# EAGLE design Crutch_Light (EAGLE 9.6.2)
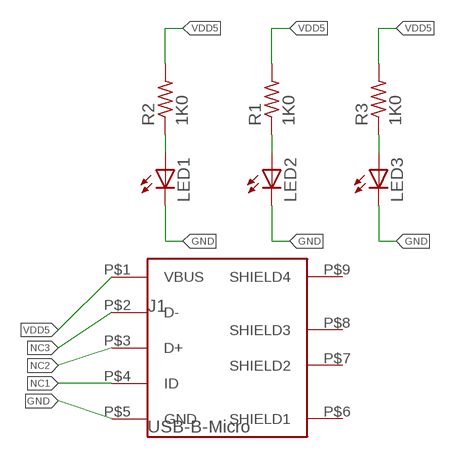
[diagram p0: schematic, sheet 1]

## Parts
J1  USB-B-Micro  USB_MICRO-B  [USB_MICRO-B]
LED1  Green  LED_0805_GREEN  [0805]
LED2  Green  LED_0805_GREEN  [0805]
LED3  Green  LED_0805_GREEN  [0805]
R1  1K0  R_0402_1K0  [0402]
R2  1K0  R_0402_1K0  [0402]
R3  1K0  R_0402_1K0  [0402]

## Nets
GND: J1.P$5(GND) LED1.2(C) LED2.2(C) LED3.2(C)
N$1: LED1.1(A) R2.P$1
N$2: LED2.1(A) R1.P$1
N$3: LED3.1(A) R3.P$1
NC1: J1.P$4(ID)
NC2: J1.P$3(D+)
NC3: J1.P$2(D-)
VDD5: J1.P$1(VBUS) R1.P$2 R2.P$2 R3.P$2
Unconnected: J1.P$6(SHIELD1) J1.P$7(SHIELD2) J1.P$8(SHIELD3) J1.P$9(SHIELD4)

## Library data of the parts
J1 = 3D_MIG_Controller:USB_MICRO-B; PARTNO: 10118192-0002LF
LED1-LED3 = 3D_MIG_Controller:LED_0805_GREEN: Green 570nm LED Indication - Discrete 2.2V 0805 (2012 Metric); PARTNO: LG R971-KN-1
R1-R3 = 3D_MIG_Controller:R_0402_1K0; PARTNO: CRG0402J1K0

## Board
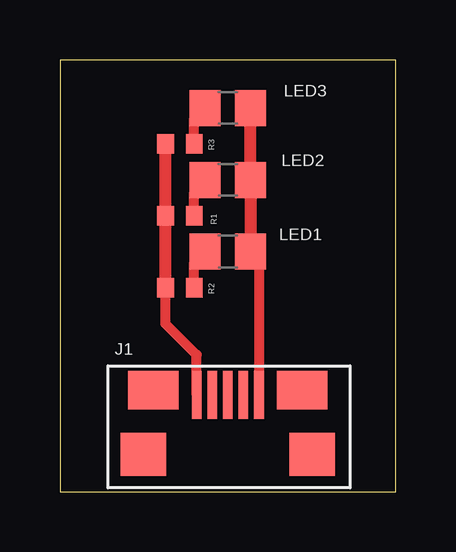
[diagram p1: board, top side]

Size 14 x 18 mm. Coordinates in mm from the lower left corner, seen from the top.
Outline: 0,0 14,0 14,18 0,18 0,0
Copper layers (1*16): Top 0.035mm / dielectric 1.5mm / Bottom 0.035mm
Design rules "default": minimum track width 6mil, minimum drill 0.35mm, track to track 6mil, track to pad 6mil, pad to pad 6mil, via to via 6mil, smd to smd 6mil, copper to edge 40mil, drill to drill 6mil, minimum pad ring 10mil, minimum via ring 8mil, stop-mask expansion 4mil, vias tented up to drill 0mil, thermal gap 10mil

### Footprints (pad centres in the part's own frame; a part is rotated, then mirrored left to right if it is on the bottom)
USB_MICRO-B = smd 0.4 x 2: P$1 -1.3,2.475; P$2 -0.65,2.475; P$3 0,2.475; P$4 0.65,2.475; P$5 1.3,2.475 | smd 2.1 x 1.6: P$6 -3.1,2.675; P$7 3.1,2.675 | smd 1.9 x 1.8: P$8 -3.525,0; P$9 3.525,0
0805 = smd 1.3 x 1.5: 1 -0.95,0; 2 0.95,0
0402 = smd 0.8 x 0.7: P$1 0,0.6; P$2 0,-0.6

### Placement (x,y rotation side)
J1  7,1.55 0 top
LED1  7,10.01 0 top
LED2  7,13 0 top
LED3  7,16 0 top
R1  5,11.5 270 top
R2  5,8.5 270 top
R3  5,14.5 270 top

### Tracks (layer width: path | path; a pad name or v marks a point on that pad's centre or on a via)
GND
  Top 0.406: LED1.2 8.3,9.96 J1.P$5
  Top 0.508: LED1.2 LED2.2 LED3.2
N$1
  Top 0.406: R2.P$1 5.6,9.56 LED1.1
N$2
  Top 0.406: R1.P$1 5.6,12.46 LED2.1
N$3
  Top 0.406: R3.P$1 5.6,15.56 LED3.1
VDD5
  Top 0.406: J1.P$1 5.7,5.7 4.4,7 R2.P$2
  Top 0.508: R2.P$2 R1.P$2 R3.P$2